# Altium project Soldeer Station.PrjPcb
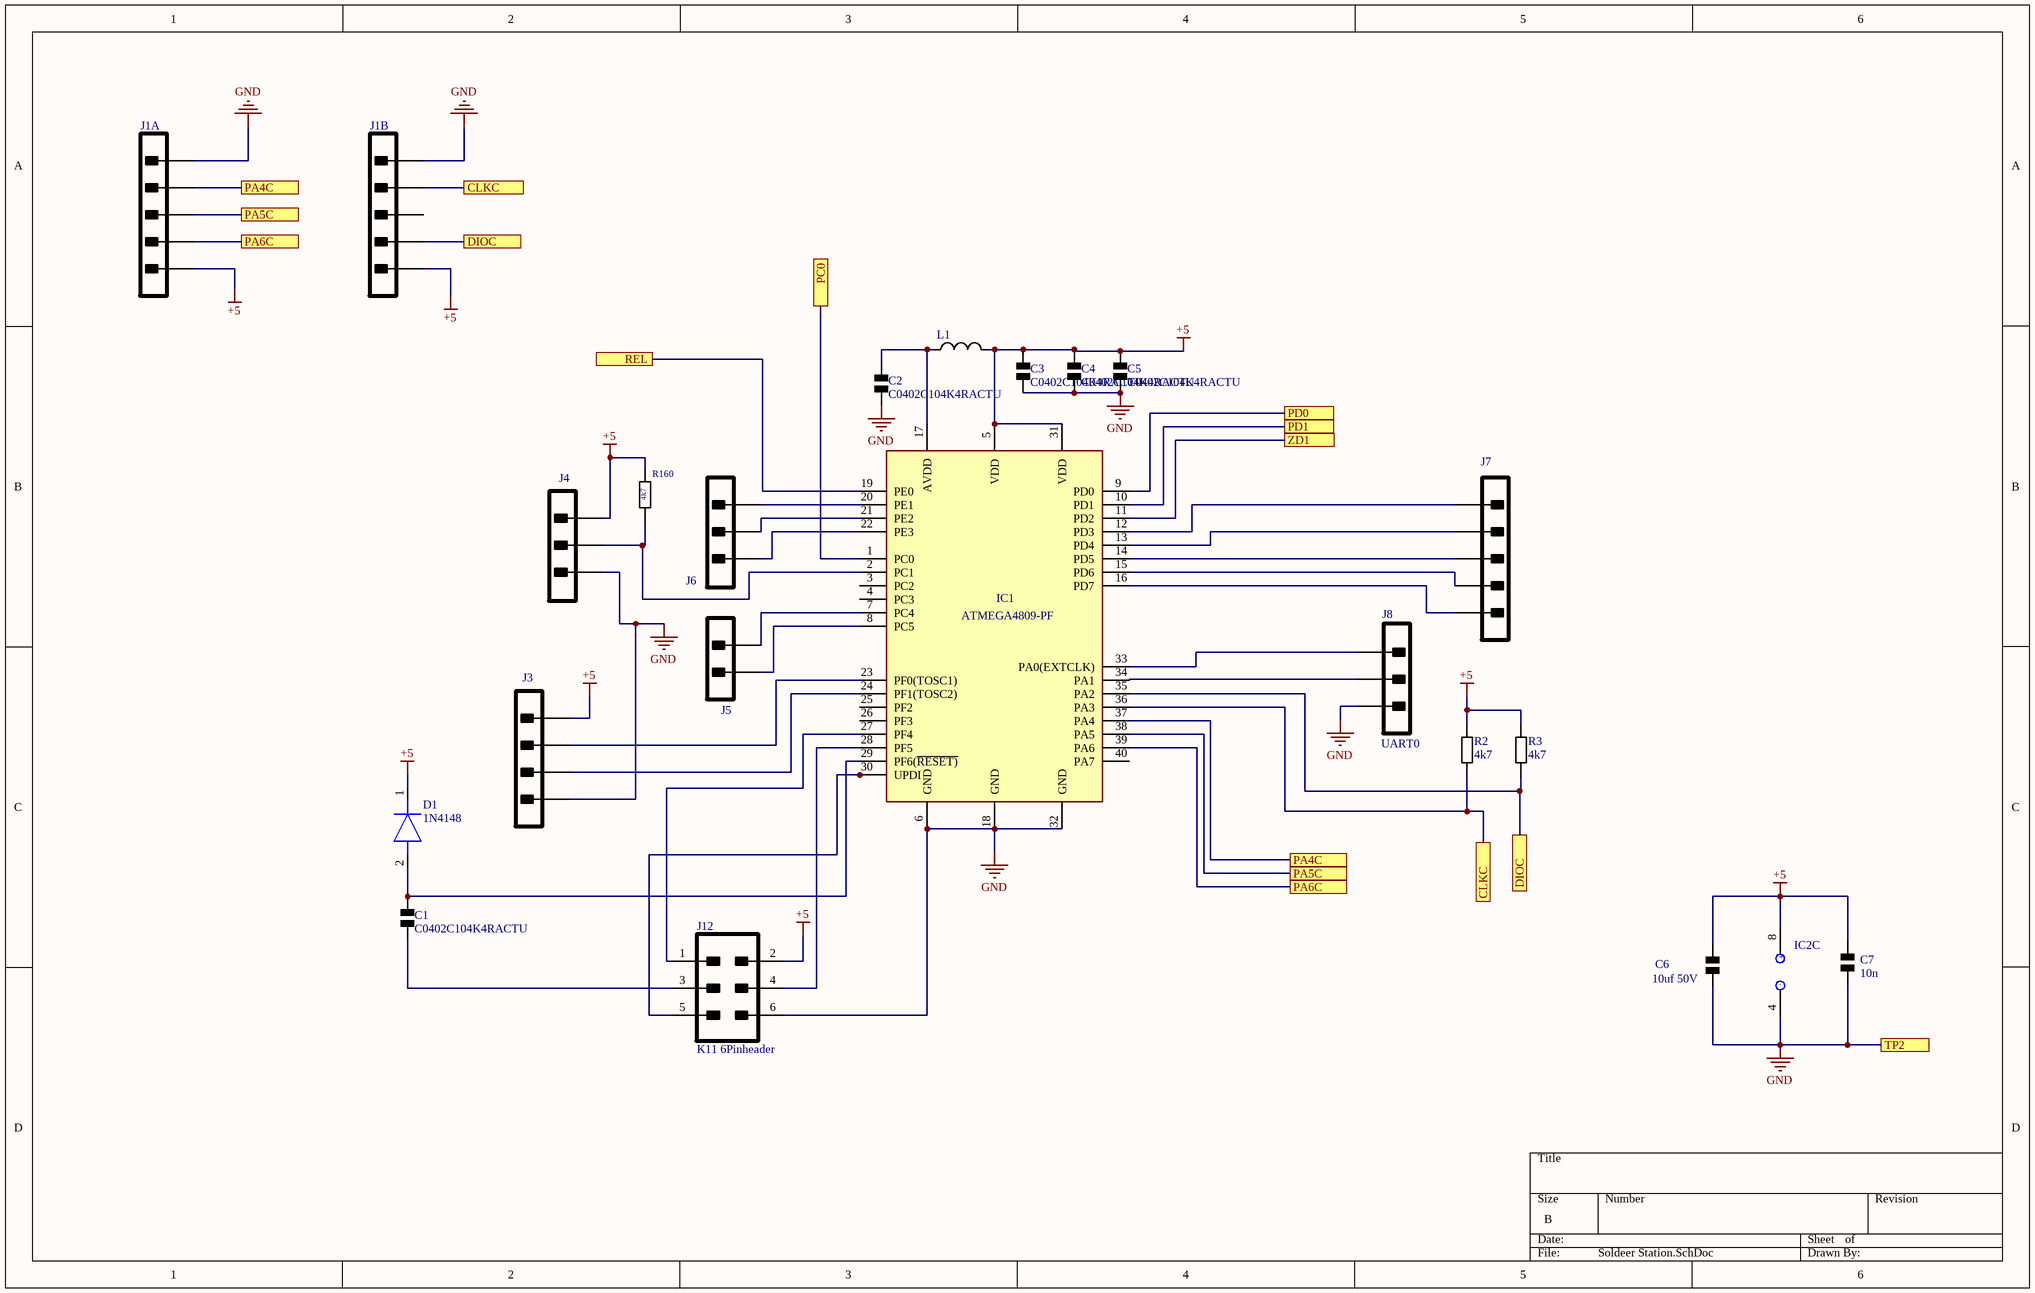
[diagram p0: Soldeer Station.SchDoc]
5 sheets, 82 parts. Net scope: flat (ports and power ports of the same name join across sheets).
Board file: Soldeer Station Final.PcbDoc
Sheets:
  Soldeer Station.SchDoc
  Display.SchDoc
  Verwarmingselement.SchDoc
  Tempmeting.SchDoc
  Batterij.SchDoc

## Sheet Soldeer Station.SchDoc
size B; SheetNumber: 1; SheetTotal: 5

### Parts
(Parts that share a designator on the sheet are numbered #1, #2 ... from top to bottom, then left to right.)
C1  C0402C104K4RACTU  [Capacitor]
C2  C0402C104K4RACTU  [Capacitor]
C3  C0402C104K4RACTU  [Capacitor]
C4  C0402C104K4RACTU  [Capacitor]
C5  C0402C104K4RACTU  [Capacitor]
C6  10uf 50V  [Capacitor]
C7  10n  [Capacitor]
D1  1N4148  [1N4007]
IC1  ATMEGA4809-PF  [ATmega4809-PF]
IC2#1  MCP6002-E/P  [MCP6002]  (value not drawn)  (part C of 3)
J1A  K9 5Pinheader  [K9 5Pinheader]  (value not drawn)
J1B  K9 5Pinheader  [K9 5Pinheader]  (value not drawn)
J3  UART2  [K6 4Pinheader]  (value not drawn)
J4  K4,7,10 3Pinheader  [K4,7,10 3Pinheader]  (value not drawn)
J5  K5 2Pinheader  [K5 2Pinheader]  (value not drawn)
J6  (no value)  [K4,7,10 3Pinheader]
J7  K9 5Pinheader  [K9 5Pinheader]  (value not drawn)
J8  UART0  [K4,7,10 3Pinheader]
J12  K11 6Pinheader  [K11 6Pinheader]
L1  (no value)  [Smoorspoel]
R2  4k7  [Resistor]
R3  4k7  [Resistor]
R160  4k7  [Resistor]

### Ports
CLKC (see Soldeer Station[2A]), CLKC (see Soldeer Station[5C]), DIOC (see Soldeer Station[2A]), DIOC (see Soldeer Station[5C]), PA4C (see Soldeer Station[1A]), PA4C (see Soldeer Station[4C]), PA5C (see Soldeer Station[1A]), PA5C (see Soldeer Station[4C]), PA6C (see Soldeer Station[1A]), PA6C (see Soldeer Station[4C]), PC0 (see Verwarmingselement[1C]), PD0 (see Tempmeting[1B]), PD1 (see Tempmeting[1C]), REL (see Batterij[2B]), TP2, ZD1 (see Batterij[4C])

### Nets
+5: C3.2 C4.1 C5.1 C6.2 C7.2 D1.1(K) IC1.5(VDD) IC1.31(VDD) IC2#1.8(VINA-) J1A.5 J1B.5 J3.1 J4.1 J12.2 L1.2 R2.2 R3.2 R160.2
GND: C2.1 C3.1 C4.2 C5.2 C6.1 C7.1 IC1.6(GND) IC1.18(GND) IC1.32(GND) IC2#1.4(VINA+) J1A.1 J1B.1 J3.4 J4.3 J8.1 J12.6 ; port TP2
NetC1_1: C1.1 J12.3
NetC1_2: C1.2 D1.2(A) IC1.29(PF6(~{RESET)})
NetC2_2: C2.2 IC1.17(AVDD) L1.1
NetC13_2: IC1.10(PD1) ; port PD1
NetC14_2: IC1.9(PD0) ; port PD0
NetIC1_1: IC1.1(PC0) ; port PC0
NetIC1_2: IC1.2(PC1) J4.2 R160.1
NetIC1_7: IC1.7(PC4) J5.1
NetIC1_8: IC1.8(PC5) J5.2
NetIC1_11: IC1.11(PD2) ; port ZD1
NetIC1_12: IC1.12(PD3) J7.5
NetIC1_13: IC1.13(PD4) J7.4
NetIC1_14: IC1.14(PD5) J7.3
NetIC1_15: IC1.15(PD6) J7.2
NetIC1_16: IC1.16(PD7) J7.1
NetIC1_19: IC1.19(PE0) ; port REL
NetIC1_20: IC1.20(PE1) J6.1
NetIC1_21: IC1.21(PE2) J6.2
NetIC1_22: IC1.22(PE3) J6.3
NetIC1_23: IC1.23(PF0(TOSC1)) J3.2
NetIC1_24: IC1.24(PF1(TOSC2)) J3.3
NetIC1_27: IC1.27(PF4) J12.1
NetIC1_28: IC1.28(PF5) J12.4
NetIC1_30: IC1.30(UPDI) J12.5
NetIC1_33: IC1.33(PA0(EXTCLK)) J8.3
NetIC1_34: IC1.34(PA1) J8.2
NetIC1_35: IC1.35(PA2) J1B.4 R3.1 ; port DIOC
NetIC1_36: IC1.36(PA3) J1B.2 R2.1 ; port CLKC
NetIC1_37: IC1.37(PA4) J1A.2 ; port PA4C
NetIC1_38: IC1.38(PA5) J1A.3 ; port PA5C
NetIC1_39: IC1.39(PA6) J1A.4 ; port PA6C

Not connected (* = marked no-connect by the designer): IC1 3(PC2) 4(PC3) 25(PF2) 26(PF3) 40(PA7); J1B 3

### Notes on the sheet
- (in symbol MCP6002, part C) +; -

### Library data of the parts
C1-C5 = Condensator: Manufacturer: Kemet; Part Number: C0402C104K4RACTU
C6 C7 = Condensator: Manufacturer: Kemet; Part Number: C0402C104K4RACTU
D1 = 1N4148,133: Diode; Manufacturer_Name: Nexperia; Datasheet Link: https://assets.nexperia.com/documents/data-sheet/1N4148_1N4448.pdf; Manufacturer_Part_Number: 1N4148,133; Mouser Part Number: 771-1N4148,133; Mouser Price/Stock: https://www.mouser.co.uk/ProductDetail/Nexperia/1N4148133?qs=elmhQ6eFu7hy8ApvpFxPZg%3D%3D; Arrow Part Number: 1N4148,133; Arrow Price/Stock: https://www.arrow.com/en/products/1n4148133/nxp-semiconductors
IC2#1 = MCP6002: None; Slew Rate: 0.6V/µs; Supply Current: 100uA; Power Supply Rejection Ratio (PSRR): 86dB; Input Offset Voltage (Vos): 4.5mV; Input Bias Current: 1pA; Amplifier Type: GENERAL PURPOSE; Unity Gain Bandwidth Product: 1MHz; Number of Circuits: 2; Output Current: 23mA; Operating Supply Voltage: 5.5V; Min Supply Voltage: 1.8V; Common Mode Rejection Ratio: 60dB; Voltage Gain: 112dB; Max Supply Voltage: 6V; Package Quantity: 60; REACH SVHC: No SVHC; Min Operating Temperature: -40°C; Max Operating Temperature: 125°C; Mount: Through Hole; Nominal Supply Current: 100uA; Height: 3.3mm; Length: 9.27mm; Slew Rate-Nom: 0.6V/µs; Packaging: Rail/Tube; Output Current per Channel: 23mA; Number of Amplifiers: 2; RoHS Compliant: Yes; Radiation Hardening: No; Bandwidth: 1MHz; Lead Free: Lead Free; Width: 6.35mm; Number of Channels: 2; Gain Bandwidth Product: 1MHz; Technology: CMOS; Operating Supply Current: 100uA; Number of Elements: 2; Number of Pins: 8; Input Offset Voltage-Max: 4.5mV; Case/Package: PDIP
J1A J1B J7 = K9 5Pinheader: NexarPartId: 278173; Voltage Rating: 250V; Number of Contacts: 5; Contact Resistance: 20mΩ; Gender: Male; Pitch: 2.54mm; Connector Type: Male Pin; Current Rating: 4A; Glow Wire Compliant: Non-compliant; Max Voltage Rating (DC): 250.25kV; Flammability Rating: UL94 V-0; Min Operating Temperature: 0°C; REACH SVHC: Unknown; Lead Free: Lead Free; Termination: Solder; RoHS: Compliant; Schedule B: 8536694040|8536694040|8536694040|8536694040|8536694040|8536694040|8536694040|8536694040|8536694040|8536694040|8536694040|8536694040|8536694040|8536694040|8536694040|8536694040|8536694040|8536694040|8536694040|8536694040|8536694040|8536694040|8536694040|85; Number of Circuits: 5; Mount: Through Hole; Lead Pitch: 2.54mm; Height: 2.29mm; Voltage Rating (DC): 250V; Max Operating Temperature: 75°C; Width: 2.49mm; Radiation Hardening: No; Contact Plating: Tin; Orientation: Vertical; Length: 12.7mm; Number of Rows: 1; Housing Material: Thermoplastic; Contact Material: Brass; Packaging: Bulk; Contact Mating Length: 6.096mm; Housing Color: Black; Color: Black; Number of Positions: 5
J3 = K6 4Pinheader: NexarPartId: 278173; Voltage Rating: 250V; Number of Contacts: 5; Contact Resistance: 20mΩ; Gender: Male; Pitch: 2.54mm; Connector Type: Male Pin; Current Rating: 4A; Glow Wire Compliant: Non-compliant; Max Voltage Rating (DC): 250.25kV; Flammability Rating: UL94 V-0; Min Operating Temperature: 0°C; REACH SVHC: Unknown; Lead Free: Lead Free; Termination: Solder; RoHS: Compliant; Schedule B: 8536694040|8536694040|8536694040|8536694040|8536694040|8536694040|8536694040|8536694040|8536694040|8536694040|8536694040|8536694040|8536694040|8536694040|8536694040|8536694040|8536694040|8536694040|8536694040|8536694040|8536694040|8536694040|8536694040|85; Number of Circuits: 5; Mount: Through Hole; Lead Pitch: 2.54mm; Height: 2.29mm; Voltage Rating (DC): 250V; Max Operating Temperature: 75°C; Width: 2.49mm; Radiation Hardening: No; Contact Plating: Tin; Orientation: Vertical; Length: 12.7mm; Number of Rows: 1; Housing Material: Thermoplastic; Contact Material: Brass; Packaging: Bulk; Contact Mating Length: 6.096mm; Housing Color: Black; Color: Black; Number of Positions: 5
J4 J6 J8 = K4,7,10 3Pinheader: NexarPartId: 278173; Voltage Rating: 250V; Number of Contacts: 5; Contact Resistance: 20mΩ; Gender: Male; Pitch: 2.54mm; Connector Type: Male Pin; Current Rating: 4A; Glow Wire Compliant: Non-compliant; Max Voltage Rating (DC): 250.25kV; Flammability Rating: UL94 V-0; Min Operating Temperature: 0°C; REACH SVHC: Unknown; Lead Free: Lead Free; Termination: Solder; RoHS: Compliant; Schedule B: 8536694040|8536694040|8536694040|8536694040|8536694040|8536694040|8536694040|8536694040|8536694040|8536694040|8536694040|8536694040|8536694040|8536694040|8536694040|8536694040|8536694040|8536694040|8536694040|8536694040|8536694040|8536694040|8536694040|85; Number of Circuits: 5; Mount: Through Hole; Lead Pitch: 2.54mm; Height: 2.29mm; Voltage Rating (DC): 250V; Max Operating Temperature: 75°C; Width: 2.49mm; Radiation Hardening: No; Contact Plating: Tin; Orientation: Vertical; Length: 12.7mm; Number of Rows: 1; Housing Material: Thermoplastic; Contact Material: Brass; Packaging: Bulk; Contact Mating Length: 6.096mm; Housing Color: Black; Color: Black; Number of Positions: 5
J5 = K5 2Pinheader: NexarPartId: 278173; Voltage Rating: 250V; Number of Contacts: 5; Contact Resistance: 20mΩ; Gender: Male; Pitch: 2.54mm; Connector Type: Male Pin; Current Rating: 4A; Glow Wire Compliant: Non-compliant; Max Voltage Rating (DC): 250.25kV; Flammability Rating: UL94 V-0; Min Operating Temperature: 0°C; REACH SVHC: Unknown; Lead Free: Lead Free; Termination: Solder; RoHS: Compliant; Schedule B: 8536694040|8536694040|8536694040|8536694040|8536694040|8536694040|8536694040|8536694040|8536694040|8536694040|8536694040|8536694040|8536694040|8536694040|8536694040|8536694040|8536694040|8536694040|8536694040|8536694040|8536694040|8536694040|8536694040|85; Number of Circuits: 5; Mount: Through Hole; Lead Pitch: 2.54mm; Height: 2.29mm; Voltage Rating (DC): 250V; Max Operating Temperature: 75°C; Width: 2.49mm; Radiation Hardening: No; Contact Plating: Tin; Orientation: Vertical; Length: 12.7mm; Number of Rows: 1; Housing Material: Thermoplastic; Contact Material: Brass; Packaging: Bulk; Contact Mating Length: 6.096mm; Housing Color: Black; Color: Black; Number of Positions: 5
J12 = K11 6Pinheader: NexarPartId: 278173; Voltage Rating: 250V; Number of Contacts: 5; Contact Resistance: 20mΩ; Gender: Male; Pitch: 2.54mm; Connector Type: Male Pin; Current Rating: 4A; Glow Wire Compliant: Non-compliant; Max Voltage Rating (DC): 250.25kV; Flammability Rating: UL94 V-0; Min Operating Temperature: 0°C; REACH SVHC: Unknown; Lead Free: Lead Free; Termination: Solder; RoHS: Compliant; Schedule B: 8536694040|8536694040|8536694040|8536694040|8536694040|8536694040|8536694040|8536694040|8536694040|8536694040|8536694040|8536694040|8536694040|8536694040|8536694040|8536694040|8536694040|8536694040|8536694040|8536694040|8536694040|8536694040|8536694040|85; Number of Circuits: 5; Mount: Through Hole; Lead Pitch: 2.54mm; Height: 2.29mm; Voltage Rating (DC): 250V; Max Operating Temperature: 75°C; Width: 2.49mm; Radiation Hardening: No; Contact Plating: Tin; Orientation: Vertical; Length: 12.7mm; Number of Rows: 1; Housing Material: Thermoplastic; Contact Material: Brass; Packaging: Bulk; Contact Mating Length: 6.096mm; Housing Color: Black; Color: Black; Number of Positions: 5
L1 = Smoorspoel 10 µH: Test Frequency: 1MHz; Max DC Current: 1.6A; Inductance Tolerance: 20%; Core Material: Ferrite; Self Resonant Frequency: 20MHz; DC Resistance (DCR): 36mR; Inductance: 10uH; Shielding: Shielded; Radiation Hardening: No; Height: 4.7mm; Lead Free: Lead Free; Current Rating: 1.6A; Length: 0.248inch; REACH SVHC: No SVHC; Military Standard: Not; Max Operating Temperature: 80°C; Packaging: Tape and Reel; Height - Seated (Max): 0.197inch; Depth: 6.6mm; Width: 6.3mm; Package Quantity: 350; Case Code (Metric): 6363; Resistor Type: Wirewound; DC Current: 1.6A; Weight: 0.025045oz; Case/Package: 2525; Termination: SMD/SMT; Min Operating Temperature: -25°C; Tolerance: 20%; Case Code (Imperial): 2525; Mount: Surface Mount
R2 R3 R160 = Resistor: Manufacturer: Vishay Dale; Part Number: CRCW08050000Z0EA
IC1 = ATMEGA4809-PF: RoHS Compliant: Yes

## Sheet Display.SchDoc
size A4; SheetNumber: 2; SheetTotal: 5
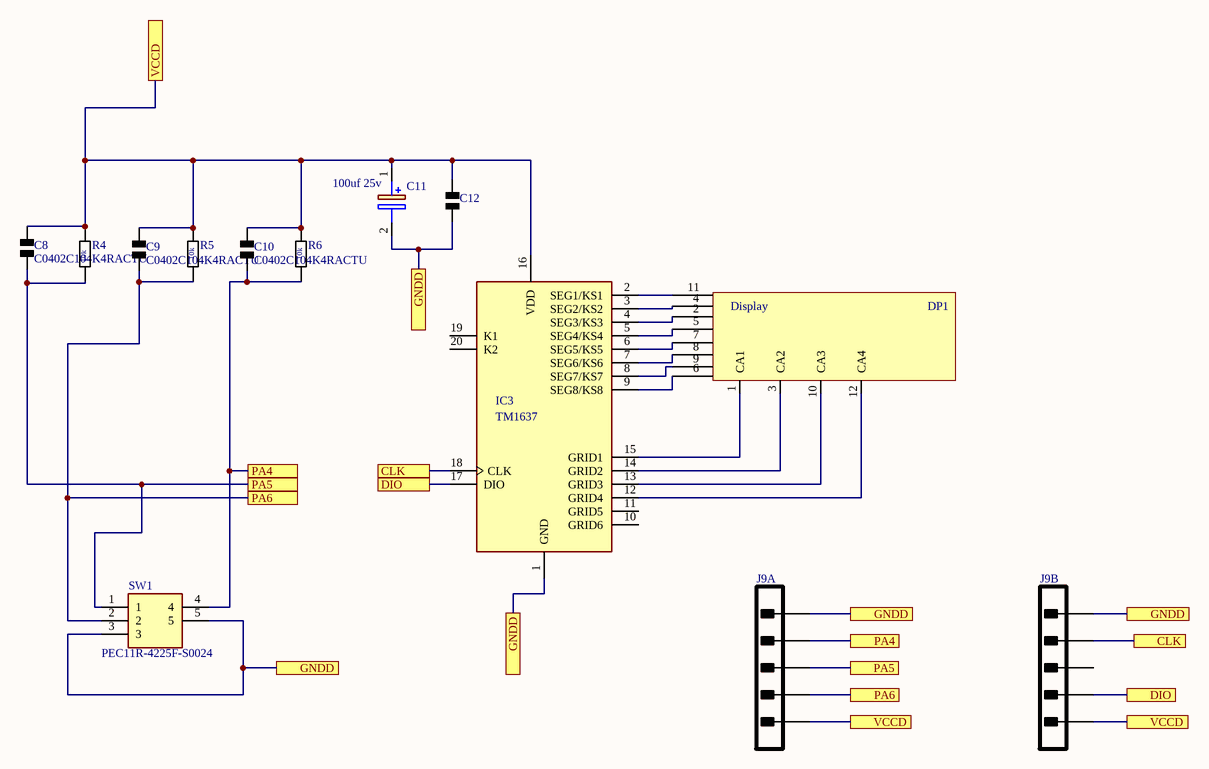
[diagram p1: Display.SchDoc]

### Parts
C8  C0402C104K4RACTU  [Capacitor]
C9  C0402C104K4RACTU  [Capacitor]
C10  C0402C104K4RACTU  [Capacitor]
C11  100uf 25v  [100uf 25v]
C12  C0402C104K4RACTU  [Capacitor]  (value not drawn)
DP1  Display  [DIP12]
IC3  TM1637  [TM1637]
J9A  K9 5Pinheader  [K9 5Pinheader]  (value not drawn)
J9B  K9 5Pinheader  [K9 5Pinheader]  (value not drawn)
R4  10k  [Resistor]
R5  10k  [Resistor]
R6  10k  [Resistor]
SW1  PEC11R-4225F-S0024  [PEC11 S1]

### Ports
CLK (see Display[2C]), CLK (see Display[4C]), DIO (see Display[2C]), DIO (see Display[4D]), GNDD (see Display[2B], Display[2C], Display[3C]), GNDD (see Display[2B], Display[2C], Display[3C], Display[4C]), GNDD (see Display[2B], Display[3C], Display[4C]), GNDD (see Display[2C], Display[3C], Display[4C]), PA4 (see Display[2C]), PA4 (see Display[3C]), PA5 (see Display[2C]), PA5 (see Display[3C]), PA6 (see Display[2C]), PA6 (see Display[3D]), VCCD (see Display[2A], Display[3D]), VCCD (see Display[2A], Display[4D]), VCCD (see Display[3D], Display[4D])

### Nets
NetC8_1: C8.1 J9A.3 R4.1 SW1.1 ; port PA5
NetC8_2: C8.2 C9.2 C10.2 C11.1(+) C12.2 IC3.16(VDD) J9A.5 J9B.5 R4.2 R5.2 R6.2 ; port VCCD
NetC9_1: C9.1 J9A.4 R5.1 SW1.2 ; port PA6
NetC10_1: C10.1 J9A.2 R6.1 SW1.4 ; port PA4
NetC11_2: C11.2(-) C12.1 IC3.1(GND) J9A.1 J9B.1 SW1.3 SW1.5 ; port GNDD
NetDP1_1: DP1.1(CA1) IC3.15(GRID1)
NetDP1_2: DP1.2 IC3.4(SEG3/KS3)
NetDP1_3: DP1.3(CA2) IC3.14(GRID2)
NetDP1_4: DP1.4 IC3.3(SEG2/KS2)
NetDP1_5: DP1.5 IC3.5(SEG4/KS4)
NetDP1_6: DP1.6 IC3.9(SEG8/KS8)
NetDP1_7: DP1.7 IC3.6(SEG5/KS5)
NetDP1_8: DP1.8 IC3.7(SEG6/KS6)
NetDP1_9: DP1.9 IC3.8(SEG7/KS7)
NetDP1_10: DP1.10(CA3) IC3.13(GRID3)
NetDP1_11: DP1.11 IC3.2(SEG1/KS1)
NetDP1_12: DP1.12(CA4) IC3.12(GRID4)
NetIC3_17: IC3.17(DIO) J9B.4 ; port DIO
NetIC3_18: IC3.18(CLK) J9B.2 ; port CLK

Not connected (* = marked no-connect by the designer): IC3 10(GRID6) 11(GRID5) 19(K1) 20(K2); J9B 3

### Library data of the parts
C8-C10 C12 = Condensator: Manufacturer: Kemet; Part Number: C0402C104K4RACTU
C11 = 100uf 25v: Capacitor Polarised; Manufacturer_Name: Chemi-Con; Manufacturer_Part_Number: ESMG250ELL101MF11D; Datasheet Link: http://www.chemi-con.co.jp/cgi-bin/CAT_DB/SEARCH/cat_db_al.cgi?e=e&j=p&pdfname=smg; Height: 12.5mm; Mouser Part Number: 661-ESMG250ELL101MF; Mouser Price/Stock: https://www.mouser.co.uk/ProductDetail/Chemi-Con/ESMG250ELL101MF11D?qs=46VwSHQt9xX2tXRf6ZkiIw%3D%3D; Arrow Part Number: ESMG250ELL101MF11D; Arrow Price/Stock: https://www.arrow.com/en/products/esmg250ell101mf11d/united-chemi-con?region=nac
IC3 = TM1637: MF: Titan Micro Electronics; Package: Package; Availability: Not in stock; SnapEDA_Link: https://www.snapeda.com/parts/TM1637/Titan+Micro+Electronics/view-part/?ref=snap; MP: TM1637; Check_prices: https://www.snapeda.com/parts/TM1637/Titan+Micro+Electronics/view-part/?ref=eda; Value: *; Price: None
J9A J9B = K9 5Pinheader: as J1A on sheet Soldeer Station; Flammability Rating: UL94 V-0; Min Operating Temperature: 0°C; REACH SVHC: Unknown; Lead Free: Lead Free; Termination: Solder; RoHS: Compliant; Schedule B: 8536694040|8536694040|8536694040|8536694040|8536694040|8536694040|8536694040|8536694040|8536694040|8536694040|8536694040|8536694040|8536694040|8536694040|8536694040|8536694040|8536694040|8536694040|8536694040|8536694040|8536694040|8536694040|8536694040|85; Number of Circuits: 5; Mount: Through Hole; Lead Pitch: 2.54mm; Height: 2.29mm; Voltage Rating (DC): 250V; Max Operating Temperature: 75°C; Width: 2.49mm; Radiation Hardening: No; Contact Plating: Tin; Orientation: Vertical; Length: 12.7mm; Number of Rows: 1; Housing Material: Thermoplastic; Contact Material: Brass; Packaging: Bulk; Contact Mating Length: 6.096mm; Housing Color: Black; Color: Black; Number of Positions: 5
R4-R6 = Resistor: as R2 on sheet Soldeer Station
SW1 = PEC11R-4225F-S0024: Undefined or Miscellaneous; Manufacturer_Name: Bourns; Datasheet Link: https://componentsearchengine.com/Datasheets/1/PEC11R-4225F-S0024.pdf; Manufacturer_Part_Number: PEC11R-4225F-S0024; Mouser Part Number: 652-PEC11R-4225F-S24; Mouser Price/Stock: https://www.mouser.co.uk/ProductDetail/Bourns/PEC11R-4225F-S0024?qs=Zq5ylnUbLm4N6UNkPX3pkQ%3D%3D; Arrow Part Number: PEC11R-4225F-S0024; Arrow Price/Stock: https://www.arrow.com/en/products/pec11r-4225f-s0024/bourns?region=nac

## Sheet Verwarmingselement.SchDoc
size A; SheetNumber: 3; SheetTotal: 5
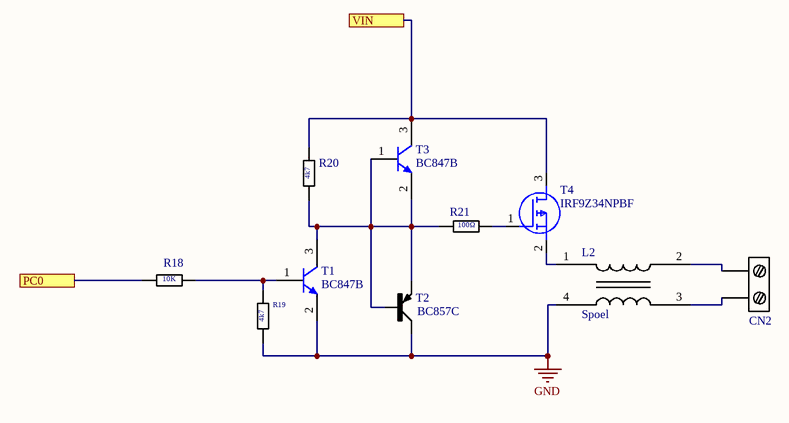
[diagram p2: Verwarmingselement.SchDoc]

### Parts
CN2  (no value)  [K1,K2,K3,K8 Printkroonsteen]
L2  Spoel  [CM2545x171B-10]
R18  10K  [Resistor]
R19  4k7  [Resistor]
R20  4k7  [Resistor]
R21  100Ω  [Resistor]
T1  BC847B  [bc847b]
T2  BC857C  [BC557C]
T3  BC847B  [bc847b]
T4  IRF9Z34NPBF  [TO254P469X1042X1967-3P]

### Ports
PC0 (see Soldeer Station[3A]), VIN (see Batterij[3C])

### Nets
GND: L2.4 R19.1 T1.2(E) T2.C
NetCN2_1: CN2.1 L2.2
NetCN2_2: CN2.2 L2.3
NetCN7_1: R20.2 T3.3(C) T4.3(D) ; port VIN
NetIC1_1: R18.1 ; port PC0
NetL2_1: L2.1 T4.2(S)
NetR18_2: R18.2 R19.2 T1.1(B)
NetR20_1: R20.1 R21.1 T1.3(C) T2.B T2.E T3.1(B) T3.2(E)
NetR21_2: R21.2 T4.1(G)

### Library data of the parts
CN2 = K1,K2,K3,K8 Printkroonsteen: MF: TE Connectivity; MP: 282837-2; SnapEDA_Link: https://www.snapeda.com/parts/282837-2/TE+Connectivity+AMP+Connectors/view-part/?ref=snap; Price: None; Check_prices: https://www.snapeda.com/parts/282837-2/TE+Connectivity+AMP+Connectors/view-part/?ref=eda; Purchase-URL: https://pricing.snapeda.com/search/part/282837-2/?ref=eda; Value: *; Availability: In Stock; Package: None
L2 = Common Mode Smoorspoel: Lead Diameter: 0.9mm; Voltage Rating (DC): 300V; Current: 700mA; Inductance: 10mH; Lead/Base Style: Pin; DC Resistance (DCR): 100mR; Shielding: Unshielded; Number of Lines: 2; Packaging: Bulk; Max Operating Temperature: 120°C; Depth: 16mm; Width: 0.63inch; Radiation Hardening: No; Max DC Current: 700mA; Package Quantity: 1260; Height: 17.5mm; Current Rating: 700mA; Military Standard: Not; Lead Free: Lead Free; Orientation: Vertical; DC Current: 700mA; Termination: Radial; Insulation Resistance: 100MR; Length: 18mm; Mount: Through Hole; Lead Pitch: 13mm; Min Operating Temperature: -25°C; REACH SVHC: No SVHC
R18-R21 = Resistor: as R2 on sheet Soldeer Station
T1 T3 = BC847B: NPN Silicon AF Transistor, 45 V VCEO, 100 mA IC, SOT23, Reel, Green; Manufacturer: Infineon; VEBO (max): 6Â V; ICBO (max): 15Â nA; VCBO (max): 50Â V; IBM (max): 200Â mA; Green: TRUE; Ptot (max): 330Â mW; fT (typ): 250Â MHz; IC (max): 100Â mA; VCEO (max): 45Â V; PackageDescription: 3-Pin Small Outline Transistor Package, 1.3 x 2.9 mm Body, 0.95 mm Pitch; ComponentLink3URL: http://www.infineon.com/dgdl/SOT23-Package_Overview.pdf?folderId=db3a30431936bc4b0119532290053c66&fileId=db3a30431936bc4b0119533468123c85; PackageVersion: Apr-08; Packing: Reel; ComponentLink3Description: Package Specification; ComponentLink2URL: http://www.infineon.com/dgdl/bc847series_bc848series_bc849series_bc850series.pdf?folderId=db3a304314dca389011541d30fa21656&fileId=db3a304314dca389011541d4630a1657; ComponentLink1URL: http://www.infineon.com/; ComponentLink2Description: Datasheet; Polarity: NPN; Mounting Technology: Surface Mount; PackageReference: SOT23; ICM (max): 200Â mA; ComponentLink1Description: Manufacturer URL; PartNumber: BC847B
T2 = BC557C: MP: BC557; MF: ON; Availability: In Stock; Package: E-PKG AXIAL-LEADED-2 ON Semiconductor; Value: *; Check_prices: https://www.snapeda.com/parts/BC557/Onsemi/view-part/?ref=eda; SnapEDA_Link: https://www.snapeda.com/parts/BC557/Onsemi/view-part/?ref=snap; Price: None
T4 = IRF9Z34NPBF: MOSFET (P-Channel); Manufacturer_Name: Infineon; Datasheet Link: https://www.infineon.com/dgdl/irf9z34npbf.pdf?fileId=5546d462533600a40153561220af1ddd; Height: 4.69mm; Manufacturer_Part_Number: IRF9Z34NPBF; Mouser Part Number: 942-IRF9Z34NPBF; Mouser Price/Stock: https://www.mouser.co.uk/ProductDetail/Infineon-Technologies/IRF9Z34NPBF?qs=9%252BKlkBgLFf16a%2FvlD%252BMCtQ%3D%3D; Arrow Part Number: IRF9Z34NPBF; Arrow Price/Stock: https://www.arrow.com/en/products/irf9z34npbf/infineon-technologies-ag?region=europe

## Sheet Tempmeting.SchDoc
size A; SheetNumber: 4; SheetTotal: 5
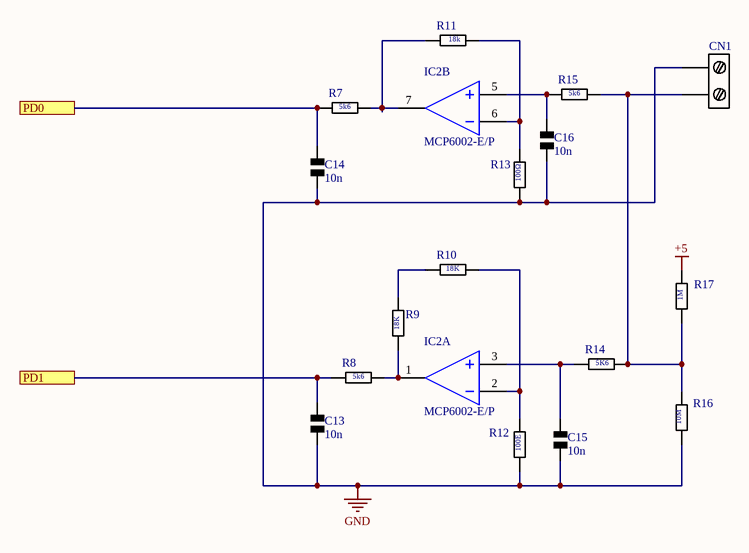
[diagram p3: Tempmeting.SchDoc]

### Parts
(Parts that share a designator on the sheet are numbered #1, #2 ... from top to bottom, then left to right.)
C13  10n  [Capacitor]
C14  10n  [Capacitor]
C15  10n  [Capacitor]
C16  10n  [Capacitor]
CN1  (no value)  [K1,K2,K3,K8 Printkroonsteen]
IC2#2  MCP6002-E/P  [MCP6002]  (parts A,B of 2)
R7  5k6  [Resistor]
R8  5k6  [Resistor]
R9  18K  [Resistor]
R10  18K  [Resistor]
R11  18k  [Resistor]
R12  100E  [Resistor]
R13  100Ω  [Resistor]
R14  5K6  [Resistor]
R15  5k6  [Resistor]
R16  10M  [Resistor]
R17  1M  [Resistor]

### Ports
PD0 (see Soldeer Station[4B]), PD1 (see Soldeer Station[4B])

### Nets
+5: R17.2
GND: C13.1 C14.1 C15.1 C16.1 CN1.1 R12.1 R13.1 R16.1
NetC13_2: C13.2 R8.1 ; port PD1
NetC14_2: C14.2 R7.1 ; port PD0
NetC15_2: C15.2 IC2#2.3(VINA+) R14.1
NetC16_2: C16.2 IC2#2.5(VINB+) R15.1
NetCN1_2: CN1.2 R14.2 R15.2 R16.2 R17.1
NetIC2#2_1: IC2#2.1(VOUTA) R8.2 R9.1
NetIC2#2_2: IC2#2.2(VINA-) R10.2 R12.2
NetIC2#2_6: IC2#2.6(VINB-) R11.2 R13.2
NetIC2#2_7: IC2#2.7(VOUTB) R7.2 R11.1
NetR9_2: R9.2 R10.1

### Library data of the parts
C13-C16 = Condensator: as C6 on sheet Soldeer Station
CN1 = K1,K2,K3,K8 Printkroonsteen: MF: TE Connectivity; MP: 282837-2; SnapEDA_Link: https://www.snapeda.com/parts/282837-2/TE+Connectivity+AMP+Connectors/view-part/?ref=snap; Price: None; Check_prices: https://www.snapeda.com/parts/282837-2/TE+Connectivity+AMP+Connectors/view-part/?ref=eda; Purchase-URL: https://pricing.snapeda.com/search/part/282837-2/?ref=eda; Value: *; Availability: In Stock; Package: None
IC2#2 = MCP6002: as IC2#1 on sheet Soldeer Station; Package Quantity: 60; REACH SVHC: No SVHC; Min Operating Temperature: -40°C; Max Operating Temperature: 125°C; Mount: Through Hole; Nominal Supply Current: 100uA; Height: 3.3mm; Length: 9.27mm; Slew Rate-Nom: 0.6V/µs; Packaging: Rail/Tube; Output Current per Channel: 23mA; Number of Amplifiers: 2; RoHS Compliant: Yes; Radiation Hardening: No; Bandwidth: 1MHz; Lead Free: Lead Free; Width: 6.35mm; Number of Channels: 2; Gain Bandwidth Product: 1MHz; Technology: CMOS; Operating Supply Current: 100uA; Number of Elements: 2; Number of Pins: 8; Input Offset Voltage-Max: 4.5mV; Case/Package: PDIP
R7-R17 = Resistor: as R2 on sheet Soldeer Station

## Sheet Batterij.SchDoc
size A; SheetNumber: 5; SheetTotal: 5
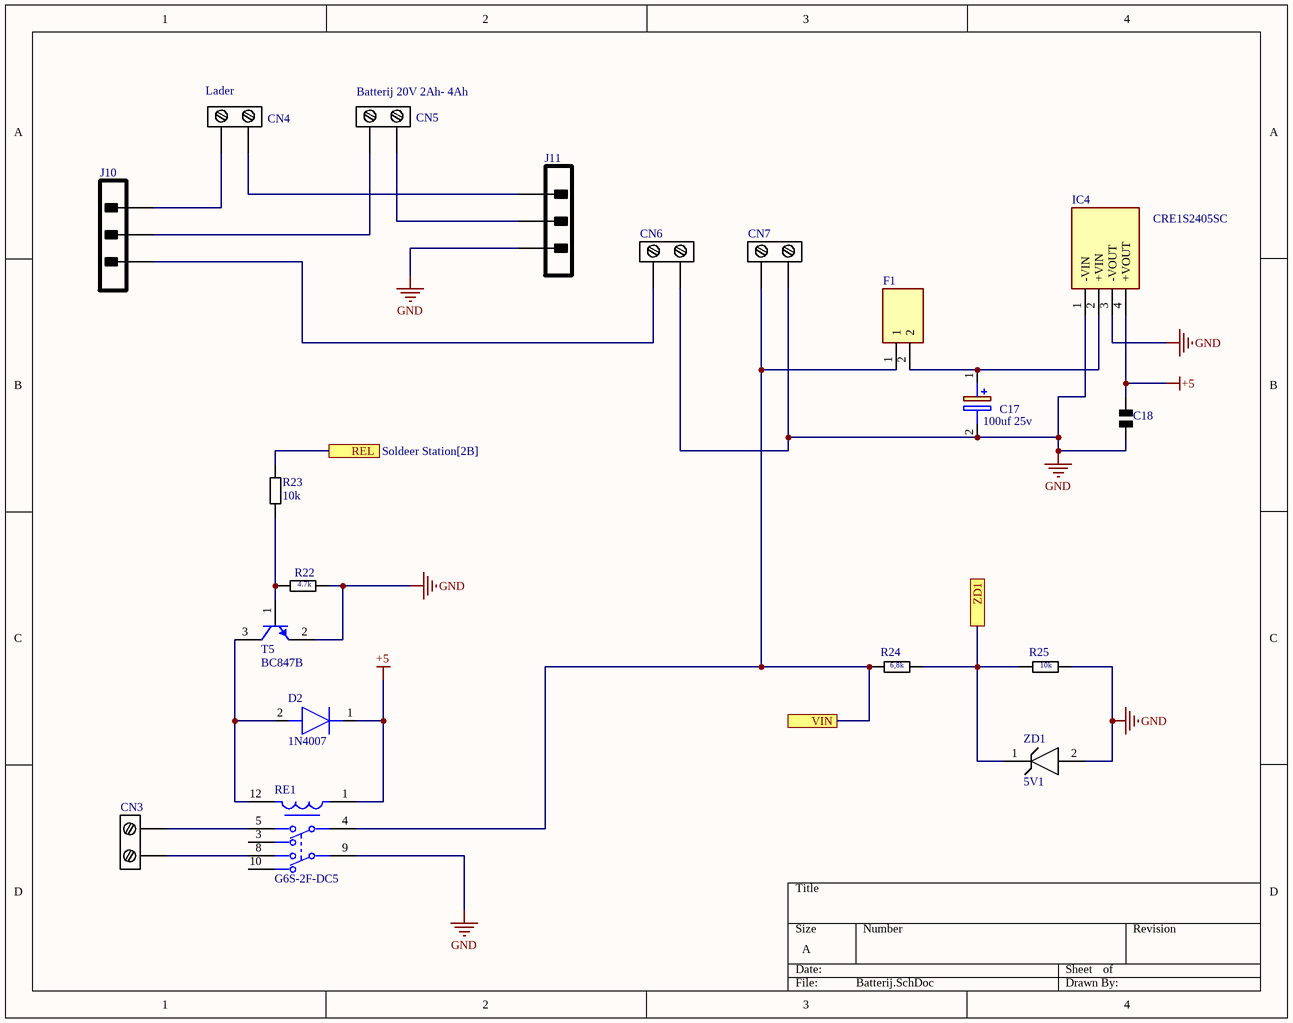
[diagram p4: Batterij.SchDoc]

### Parts
C17  100uf 25v  [100uf 25v]
C18  C0402C104K4RACTU  [Capacitor]  (value not drawn)
CN3  K1,K2,K3,K8 Printkroonsteen  [K1,K2,K3,K8 Printkroonsteen]  (value not drawn)
CN4  Lader  [K1,K2,K3,K8 Printkroonsteen]
CN5  Batterij 20V 2Ah- 4Ah  [K1,K2,K3,K8 Printkroonsteen]
CN6  K1,K2,K3,K8 Printkroonsteen  [K1,K2,K3,K8 Printkroonsteen]  (value not drawn)
CN7  K1,K2,K3,K8 Printkroonsteen  [K1,K2,K3,K8 Printkroonsteen]  (value not drawn)
D2  1N4007  [1N4007]
F1  (no value)  [65800201009]
IC4  CRE1S2405SC  [CRE1(SC)]
J10  K4,7,10 3Pinheader  [K4,7,10 3Pinheader]  (value not drawn)
J11  K4,7,10 3Pinheader  [K4,7,10 3Pinheader]  (value not drawn)
R22  4.7k  [Resistor]
R23  10k  [Resistor]
R24  6,8k  [Resistor]
R25  10k  [Resistor]
RE1  G6S-2F-DC5  [G6S-2F-DC5]
T5  BC847B  [BC847B]
ZD1  5V1  [1N4007]

### Ports
REL (see Soldeer Station[2B]), VIN (see Verwarmingselement[2B]), ZD1 (see Soldeer Station[4B])

### Nets
+5: C18.2 D2.1(K) IC4.4(+VOUT) RE1.1
GND: C17.2(-) C18.1 CN6.2 CN7.2 IC4.1(-VIN) IC4.3(-VOUT) J11.1 R22.2 R25.2 RE1.9 T5.2(C) ZD1.2(A)
NetC17_1: C17.1(+) F1.2 IC4.2(+VIN)
NetCN3_1: CN3.1 RE1.8
NetCN3_2: CN3.2 RE1.5
NetCN4_1: CN4.1 J10.1
NetCN4_2: CN4.2 J11.3
NetCN5_1: CN5.1 J10.2
NetCN5_2: CN5.2 J11.2
NetCN6_1: CN6.1 J10.3
NetCN7_1: CN7.1 F1.1 R24.1 RE1.4 ; port VIN
NetD2_2: D2.2(A) RE1.12 T5.3(E)
NetIC1_11: R24.2 R25.1 ZD1.1(C) ; port ZD1
NetIC1_19: R23.2 ; port REL
NetR22_1: R22.1 R23.1 T5.1(B)

Not connected (* = marked no-connect by the designer): RE1 3 10

### Library data of the parts
C17 = 100uf 25v: as C11 on sheet Display; Datasheet Link: http://www.chemi-con.co.jp/cgi-bin/CAT_DB/SEARCH/cat_db_al.cgi?e=e&j=p&pdfname=smg; Height: 12.5mm; Mouser Part Number: 661-ESMG250ELL101MF; Mouser Price/Stock: https://www.mouser.co.uk/ProductDetail/Chemi-Con/ESMG250ELL101MF11D?qs=46VwSHQt9xX2tXRf6ZkiIw%3D%3D; Arrow Part Number: ESMG250ELL101MF11D; Arrow Price/Stock: https://www.arrow.com/en/products/esmg250ell101mf11d/united-chemi-con?region=nac
C18 = Condensator: Manufacturer: Kemet; Part Number: C0402C104K4RACTU
CN3-CN7 = K1,K2,K3,K8 Printkroonsteen: MF: TE Connectivity; MP: 282837-2; SnapEDA_Link: https://www.snapeda.com/parts/282837-2/TE+Connectivity+AMP+Connectors/view-part/?ref=snap; Price: None; Check_prices: https://www.snapeda.com/parts/282837-2/TE+Connectivity+AMP+Connectors/view-part/?ref=eda; Purchase-URL: https://pricing.snapeda.com/search/part/282837-2/?ref=eda; Value: *; Availability: In Stock; Package: None
D2 = 1N4007: Diode; Manufacturer_Name: Vishay; Manufacturer_Part_Number: 1N4007-E3/73; Datasheet Link: https://mouser.componentsearchengine.com/Datasheets/2/1N4007-E3_73.pdf; Mouser Part Number: 625-1N4007-E3/73; Mouser Price/Stock: https://www.mouser.co.uk/ProductDetail/Vishay-General-Semiconductor/1N4007-E3-73?qs=N4vtoAxH%2FSqT3Ng3e4K0Gw%3D%3D; Arrow Part Number: 1N4007-E3/73; Arrow Price/Stock: https://www.arrow.com/en/products/1n4007-e373/vishay?region=europe
F1 = 65800201009: Hardware; Manufacturer_Name: LITTELFUSE; Datasheet Link: https://www.littelfuse.com/media?resourcetype=datasheets&itemid=8563b5b9-30c3-4ebb-8e89-3cabf2bd05b5&filename=littelfuse-fuse-block-658-datasheet; Height: 13.2mm; Manufacturer_Part_Number: 65800201009
IC4 = CRE1S2405SC: Undefined or Miscellaneous; Manufacturer_Name: Murata Electronics; Datasheet Link: http://power.murata.com/datasheet?/data/power/ncl/kdc_cre1.pdf; Manufacturer_Part_Number: CRE1S2405SC; Mouser Part Number: 580-CRE1S2405SC; Mouser Price/Stock: https://www.mouser.co.uk/ProductDetail/Murata-Power-Solutions/CRE1S2405SC?qs=pFP7BvE1PmwUsyXD%252BXcXxQ%3D%3D; Arrow Part Number: CRE1S2405SC; Arrow Price/Stock: https://www.arrow.com/en/products/cre1s2405sc/murata-power-solutions
J10 J11 = K4,7,10 3Pinheader: as J4 on sheet Soldeer Station; Flammability Rating: UL94 V-0; Min Operating Temperature: 0°C; REACH SVHC: Unknown; Lead Free: Lead Free; Termination: Solder; RoHS: Compliant; Schedule B: 8536694040|8536694040|8536694040|8536694040|8536694040|8536694040|8536694040|8536694040|8536694040|8536694040|8536694040|8536694040|8536694040|8536694040|8536694040|8536694040|8536694040|8536694040|8536694040|8536694040|8536694040|8536694040|8536694040|85; Number of Circuits: 5; Mount: Through Hole; Lead Pitch: 2.54mm; Height: 2.29mm; Voltage Rating (DC): 250V; Max Operating Temperature: 75°C; Width: 2.49mm; Radiation Hardening: No; Contact Plating: Tin; Orientation: Vertical; Length: 12.7mm; Number of Rows: 1; Housing Material: Thermoplastic; Contact Material: Brass; Packaging: Bulk; Contact Mating Length: 6.096mm; Housing Color: Black; Color: Black; Number of Positions: 5
R22-R25 = Resistor: as R2 on sheet Soldeer Station
RE1 = G6S-2F-DC5: Manufacturer: Omron; Coil Resistance: 178Ω; Switching Current: 2A; Coil Current: 28.1mA; Throw Configuration: DPDT; Coil Voltage: 5V; Standoff Height: 0.35mm; Coil Power: 140mW; Coil Type: Non-Latching; Number Of Contacts: 2; RoHS: TRUE; Device Class L3: Signal Relays; Ambient Temperature Range Low: -40°C; Device Class L1: Electromechanical; Lead Free: Yes; Category: Relay; Digikey Description: RELAY TELECOM DPDT 2A 5VDC; Height: 9.4mm; Temperature: -40°C to +85°C; Octopart: https://octopart.com/g6s-2f-dc5-omron-85236; Package: G6S-2F-DC5; Temperature Range High: +85°C; Automotive: No; Current Rating: 2A; Manufacturer Part Number: G6S-2F-DC5; Mouser Description: Electromechanical Relay 5VDC 178Ohm 2A DPDT (14.8x9.2x9.2)mm SMD Signal Relay; Temperature Range Low: -40°C; Device Class L2: Relays; Ambient Temperature Range High: +85°C; ComponentLink2URL: https://omronfs.omron.com/en_US/ecb/products/pdf/en-g6s.pdf; ComponentLink2Description: Datasheet
T5 = BC847B: NPN Silicon AF Transistor; Manufacturer: Infineon; VEBO (max): 6Â V; ICBO (max): 15Â nA; VCBO (max): 50Â V; IBM (max): 200Â mA; Packing: Reel; Green: TRUE; Ptot (max): 330Â mW; fT (typ): 250Â MHz; IC (max): 100Â mA; VCEO (max): 45Â V; PackageDescription: 3-Pin Small Outline Transistor Package, 1.3 x 2.9 mm Body, 0.95 mm Pitch; ComponentLink3URL: http://www.infineon.com/dgdl/SOT23-Package_Overview.pdf?folderId=db3a30431936bc4b0119532290053c66&fileId=db3a30431936bc4b0119533468123c85; PackageVersion: Apr-08; ComponentLink3Description: Package Specification; ComponentLink2URL: http://www.infineon.com/dgdl/bc847series_bc848series_bc849series_bc850series.pdf?folderId=db3a304314dca389011541d30fa21656&fileId=db3a304314dca389011541d4630a1657; ComponentLink1URL: http://www.infineon.com/; ComponentLink2Description: Datasheet; Polarity: NPN; Mounting Technology: Surface Mount; PackageReference: SOT23; ICM (max): 200Â mA; ComponentLink1Description: Manufacturer URL; PartNumber: BC847B
ZD1 = Zenerdiode: BZM55B5V1-TR; Zener Voltage: 5.1V; Element Configuration: Single; Impedance: 60R; ESD Protection: No; Voltage Tolerance: 2%; Power Dissipation: 500mW; Max Reverse Leakage Current: 100nA; Test Current: 5mA; Max Operating Temperature: 175°C; Series: -; Package Quantity: 12500; Min Operating Temperature: -65°C; Radiation Hardening: No; RoHS Compliant: Yes; Contact Plating: Tin; Max Power Dissipation: 500mW; Number of Pins: 2; Packaging: Tape and Reel; Mount: Surface Mount; Case/Package: SMD/SMT

## Nets that join several sheets
+5: Soldeer Station (18 pins), Tempmeting (R17.2), Batterij (C18.2 D2.1 IC4.4 RE1.1)
GND: Soldeer Station (16 pins), Verwarmingselement (L2.4 R19.1 T1.2 T2.C), Tempmeting (8 pins), Batterij (12 pins)
NetC13_2: Soldeer Station (IC1.10), Tempmeting (C13.2 R8.1)
NetC14_2: Soldeer Station (IC1.9), Tempmeting (C14.2 R7.1)
NetCN7_1: Verwarmingselement (R20.2 T3.3 T4.3), Batterij (CN7.1 F1.1 R24.1 RE1.4)
NetIC1_1: Soldeer Station (IC1.1), Verwarmingselement (R18.1)
NetIC1_11: Soldeer Station (IC1.11), Batterij (R24.2 R25.1 ZD1.1)
NetIC1_19: Soldeer Station (IC1.19), Batterij (R23.2)